# Altium schematic sheet mcu.SchDoc
size A4
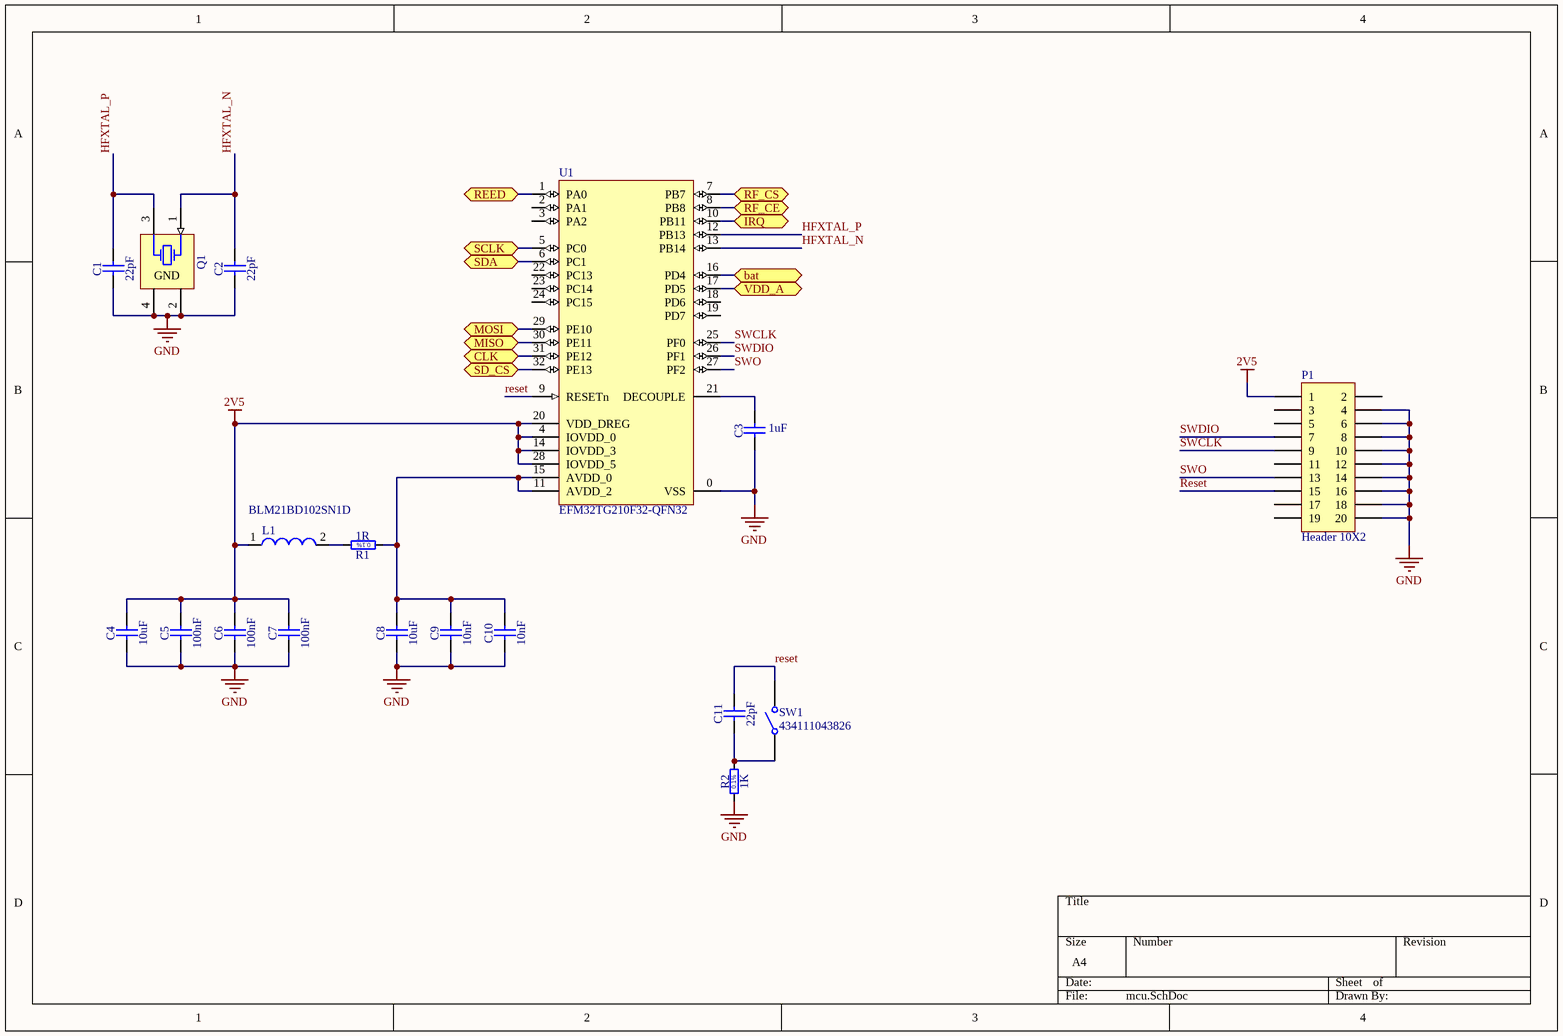
[diagram p0: mcu.SchDoc]

## Parts
C1  22pF  [CAPC2012X135N]
C2  22pF  [CAPC2012X135N]
C3  1uF  [CAPC2012X135N]
C4  10uF  [CAPC2012X135N]
C5  100nF  [CAPC2012X135N]
C6  100nF  [CAPC2012X135N]
C7  100nF  [CAPC2012X135N]
C8  10uF  [CAPC2012X135N]
C9  10nF  [CAPC2012X135N]
C10  10nF  [CAPC2012X135N]
C11  22pF  [CAPC2012X135N]
L1  BLM21BD102SN1D  [6-0805]
P1  Header 10X2  [HDR2X10]
Q1  25MHz  [XTAL_EPSON_TSX-3225]  (value not drawn)
R1  1R  [RESC2012X60N]
R2  1K  [RESC2012X60N]
SW1  434111043826  [434111043826]
U1  EFM32TG210F32-QFN32  [ENMR-QFN32_N]

## Ports
bat, CLK, IRQ, MISO, MOSI, REED, RF_CE, RF_CS, SCLK, SD_CS, SDA, VDD_A

## Nets
2V5: C4.2 C5.2 C6.2 C7.2 L1.1 P1.1 U1.4(IOVDD_0) U1.14(IOVDD_3) U1.20(VDD_DREG) U1.28(IOVDD_5)
GND: C1.1 C2.1 C3.1 C4.1 C5.1 C6.1 C7.1 C8.1 C9.1 C10.1 P1.4 P1.6 P1.8 P1.10 P1.12 P1.14 P1.16 P1.18 P1.20 Q1.2(GND) Q1.4(GND) R2.1 U1.0(VSS)
bat: U1.16(PD4) ; port bat
CLK: U1.31(PE12) ; port CLK
HFXTAL_N: C2.2 Q1.1(X) U1.13(PB14)
HFXTAL_P: C1.2 Q1.3(X) U1.12(PB13)
IRQ: U1.10(PB11) ; port IRQ
MISO: U1.30(PE11) ; port MISO
MOSI: U1.29(PE10) ; port MOSI
REED: U1.1(PA0) ; port REED
Reset: C11.2 P1.15 SW1.2 U1.9(RESETn)
RF_CE: U1.8(PB8) ; port RF_CE
RF_CS: U1.7(PB7) ; port RF_CS
SCLK: U1.5(PC0) ; port SCLK
SD_CS: U1.32(PE13) ; port SD_CS
SDA: U1.6(PC1) ; port SDA
SWCLK: P1.9 U1.25(PF0)
SWDIO: P1.7 U1.26(PF1)
SWO: P1.13 U1.27(PF2)
VDD_A: U1.17(PD5) ; port VDD_A
NetC3_2: C3.2 U1.21(DECOUPLE)
NetC8_2: C8.2 C9.2 C10.2 R1.1 U1.11(AVDD_2) U1.15(AVDD_0)
NetC11_1: C11.1 R2.2 SW1.1
NetL1_2: L1.2 R1.2

Not connected (* = marked no-connect by the designer): P1 2 3 5 11 17 19; U1 2(PA1) 3(PA2) 18(PD6) 19(PD7) 22(PC13) 23(PC14) 24(PC15)

## Notes on the sheet
- (in symbol R0805_1K1_0.1%_0.1W_10PPM) 0.1%

## Library data of the parts
C1 C2 C4-C11 = CC0805_10NF_50V_10%_X7R: Non-polarised capacitor; Part Description: SMD Multilayer Chip Ceramic Capacitor; Manufacturer: GENERIC; Manufacturer1 Part Number: B37941K5103K60; Voltage: 50V; TC: X7R; Tolerance: ±10%; Table: Capacitors SMD; Part Number: CC0805_10NF_50V_10%_X7R; Component Kind: Standard; Component Type: Standard; Pin Count: 2; Status: Preferred; Manufacturer Part Number: CC0805_10NF_50V_10%_X7R; Case: 0805; Mounted: Yes; Socket: No; SMD: Yes; Manufacturer1 Example: EPCOS; Manufacturer1 ComponentHeight: 1.35mm; HelpURL: \\cern.ch\dfs\Applications\Altium\Datasheets\CC0805_X7R_EPCOS.pdf; Author: CERN DEM JLC; CreateDate: 03.12.2007; LatestRevisionDate: 03.12.2007
  C1 C2 C11: Value: 22pF
  C4 C8: Value: 10uF
  C5-C7: Value: 100nF
  C9 C10: Value: 10nF
C3 = CC0805_1NF_50V_5%_X7R: Non-polarised capacitor; Part Description: SMD Multilayer Chip Ceramic Capacitor; Manufacturer: GENERIC; Manufacturer1 Part Number: 08055C102JAT2A; Voltage: 50V; TC: X7R; Tolerance: ±5%; Table: Capacitors SMD; Part Number: CC0805_1NF_50V_5%_X7R; Component Kind: Standard; Component Type: Standard; Pin Count: 2; Value: 1uF; Status: None; Manufacturer Part Number: CC0805_1NF_50V_5%_X7R; Case: 0805; Mounted: Yes; Socket: No; SMD: Yes; Manufacturer1 Example: AVX; Manufacturer1 ComponentHeight: 0.94mm; HelpURL: \\cern.ch\dfs\Applications\Altium\Datasheets\CC0805_X7R_AVX.pdf; Author: CERN DEM JLC; CreateDate: 18.01.2011; LatestRevisionDate: 18.01.2011
L1 = 7427920: SMD EMI Suppression Ferrite Bead WE-CBF, Z = 11 Ohm; Impedance: 11 Ohm; DatasheetVersion: Dec-2005; PackageReference: SMD-0805; PackageDescription: Chip Inductor, 2-Leads, Body 2.0 x 1.2 mm; PartNumber: 7427920; ComponentLink1Description: Manufacturer URL; ComponentLink1URL: http://www.we-online.com; ComponentLink2Description: Datasheet; ComponentLink2URL: http://www.we-online.de/katalog/media/pdf/7427920.pdf
P1 = Header 10X2: Header, 10-Pin, Dual row; LatestRevisionDate: 17-Jul-2002; LatestRevisionNote: Re-released for DXP Platform.; Publisher: Altium Limited
Q1 = XTAL_25MHZ_EPSON_TSX-322525.0000MF10Z-AC: Crystal 4 pins 1=XTAL Control 2=GND3=XTAL 4=GND; Part Description: Tolerance ±10 ppm,  Stability:± 10ppm, -20°C to 75°C, 9pF, Surface Mount Quartz Crystal, TX-3225 Serie; Manufacturer: EPSON; Table: Crystals & Oscillators; Part Number: XTAL_25MHZ_EPSON_TSX-322525.0000MF10Z-AC; Component Kind: Standard; Component Type: Standard; PackageDescription: Oscillator TSX-3225 Serie, Corner Concave; 4 pin, 2.50mm L X 3.2mm W X 0.6mm H; Value: 25MHz; Manufacturer Part Number: TSX-322525.0000MF10Z-AC; Pin Count: 4; Mounted: Yes; Socket: No; SMD: Yes; ComponentHeight: 0.6mm; HelpURL: \\cern.ch\dfs\Applications\Altium\Datasheets\XTAL_EPSON_TSX-3225.pdf; ComponentLink1URL: \\cern.ch\dfs\Applications\Altium\Datasheets\XTAL_EPSON_TSX-3225_Ordering-Informations.pdf; ComponentLink1Description: Ordering Informations; Author: CERN DEM JLC; CreateDate: 03.04.2012; LatestRevisionDate: 03.04.2012
R1 R2 = R0805_1K1_0.1%_0.1W_10PPM: Resistor - 0.1%; Part Description: Thin Film Chip Resistor; Manufacturer: GENERIC; Manufacturer1 Part Number: RN73C2A1K1BTG; Power: 0.1W; TC: ±10ppm; Table: Resistors SMD; Part Number: R0805_1K1_0.1%_0.1W_10PPM; Component Kind: Standard; Component Type: Standard; Pin Count: 2; Status: Not recommended; Tolerance: ±0.1%; Manufacturer Part Number: R0805_1K1_0.1%_0.1W_10PPM; Case: 0805; Mounted: Yes; Socket: No; SMD: Yes; Manufacturer1 Example: TYCO HOLSWORTHY; Manufacturer1 ComponentHeight: 0.6mm; HelpURL: \\cern.ch\dfs\Applications\Altium\Datasheets\R0805_Tyco_RN73.pdf; Author: CERN DEM JLC; CreateDate: 03.12.2007; LatestRevisionDate: 13.03.2008
  R1: Value: 1R
  R2: Value: 1K
SW1 = 434111043826: WS-TASV SMD Tact Switch 6.0X3.5 mm; NoPins: 02; PackageReference: 434111043826; PartNumber: 434111043826; ComponentLink1Description: Manufacturer URL; ComponentLink1URL: http://www.we-online.com; ComponentLink2Description: Datasheet; ComponentLink2URL: http://katalog.we-online.de/em/datasheet/434111043826.pdf
U1 = EFM32TG210F32-QFN32: EFM32 Tiny Gecko, M3 ARM Cortex CPU, 32 KB Flash, 4 KB RAM, 1.85 - 3.8 V Supply, 32 MHz Max Speed, -40 to 85 degC, 32-Pin QFN, RoHS Compliant; ADC: Y; Flash (KB): 32; GPIO: 24; OPAMPS: 3; RAM (KB): 4; DatasheetVersion: Rev 1.00; PackageVersion: Rev. 98SPP32088A_XO1_10MAR2011; PackageReference: QFN32; PackageDescription: 32-Pin Quad Flat No Lead Package, Body 6 x 6 mm, Pitch 0.65 mm; Supplier 1: Digi-Key; Supplier Part Number 1: 914-1034-2-ND; Supplier 2: Digi-Key; Supplier Part Number 2: 914-1034-1-ND; Supplier 3: Digi-Key; Supplier Part Number 3: 914-1034-6-ND; Supplier 4: Mouser; Supplier Part Number 4: 904-EFM32TG210F32; AES: Y; ARM Cortex CPU: M3; LESENSE: Y; Max Speed (MHz): 32; Subcategory: EFM32 Tiny Gecko; Supply Voltage (V): 1.85 - 3.8; Mounting Technology: Surface Mount; Generic Part Number: EFM32TG210; PartNumber: EFM32TG210F32-QFN32; ComponentLink1Description: Manufacturer URL; ComponentLink1URL: http://www.energymicro.com/; ComponentLink2Description: Datasheet; ComponentLink2URL: http://cdn.energymicro.com/dl/devices/pdf/d0012_efm32tg210_datasheet.pdf; ComponentLink3Description: Package Specification; ComponentLink3URL: http://cdn.energymicro.com/dl/devices/pdf/d0004_efm32g210_datasheet.pdf